# Altium project Table.PrjPcb
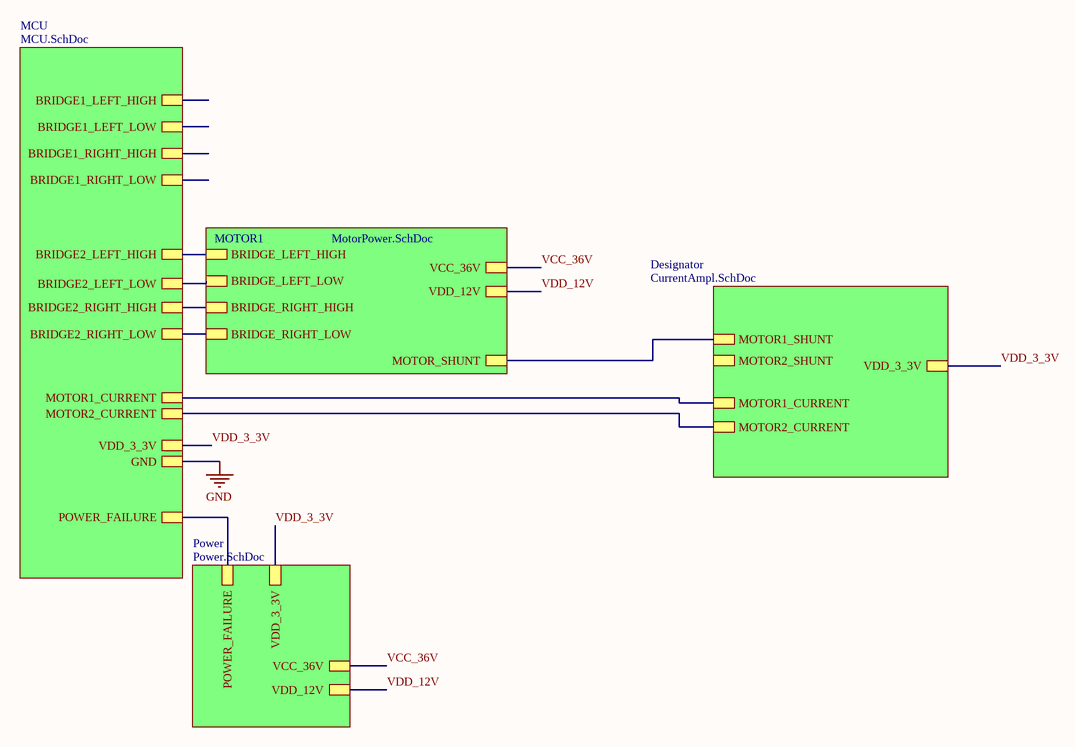
[diagram p0: Table.SchDoc]
5 sheets, 78 parts. Net scope: hierarchical (ports join the sheet entries above them; power ports are global).
Board file: PCB1.PcbDoc
Sheets:
  Table.SchDoc
    MCU = MCU.SchDoc
    MOTOR1 = MotorPower.SchDoc
    Designator = CurrentAmpl.SchDoc
    Power = Power.SchDoc

## Sheet Table.SchDoc
size A4

### Sub-sheets
Designator = CurrentAmpl.SchDoc: MOTOR1_SHUNT, MOTOR2_SHUNT, MOTOR2_CURRENT, MOTOR1_CURRENT, VDD_3_3V
MCU = MCU.SchDoc: BRIDGE1_LEFT_LOW, BRIDGE1_RIGHT_HIGH, BRIDGE1_RIGHT_LOW, BRIDGE1_LEFT_HIGH, BRIDGE2_LEFT_HIGH, BRIDGE2_RIGHT_HIGH, BRIDGE2_LEFT_LOW, BRIDGE2_RIGHT_LOW, VDD_3_3V, GND, POWER_FAILURE, MOTOR1_CURRENT, MOTOR2_CURRENT
MOTOR1 = MotorPower.SchDoc: MOTOR_SHUNT, VCC_36V, BRIDGE_LEFT_HIGH, VDD_12V, BRIDGE_LEFT_LOW, BRIDGE_RIGHT_HIGH, BRIDGE_RIGHT_LOW
Power = Power.SchDoc: POWER_FAILURE, VDD_12V, VDD_3_3V, VCC_36V

### Nets
VCC_36V: sheet MOTOR1/VCC_36V, sheet Power/VCC_36V
VDD_3_3V: sheet MCU/VDD_3_3V, sheet Designator/VDD_3_3V, sheet Power/VDD_3_3V
VDD_12V: sheet MOTOR1/VDD_12V, sheet Power/VDD_12V
NetC20_2: sheet MCU/MOTOR1_CURRENT, sheet Designator/MOTOR1_CURRENT
NetC22_2: sheet MCU/MOTOR2_CURRENT, sheet Designator/MOTOR2_CURRENT
NetR2_1: sheet MCU/POWER_FAILURE, sheet Power/POWER_FAILURE
NetR12_2: sheet MCU/BRIDGE2_LEFT_HIGH, sheet MOTOR1/BRIDGE_LEFT_HIGH
NetR14_1: sheet MCU/BRIDGE2_LEFT_LOW, sheet MOTOR1/BRIDGE_LEFT_LOW
NetR15_2: sheet MOTOR1/MOTOR_SHUNT, sheet Designator/MOTOR1_SHUNT
NetR18_2: sheet MCU/BRIDGE2_RIGHT_HIGH, sheet MOTOR1/BRIDGE_RIGHT_HIGH
NetR20_1: sheet MCU/BRIDGE2_RIGHT_LOW, sheet MOTOR1/BRIDGE_RIGHT_LOW

## Sheet MCU.SchDoc
size A4
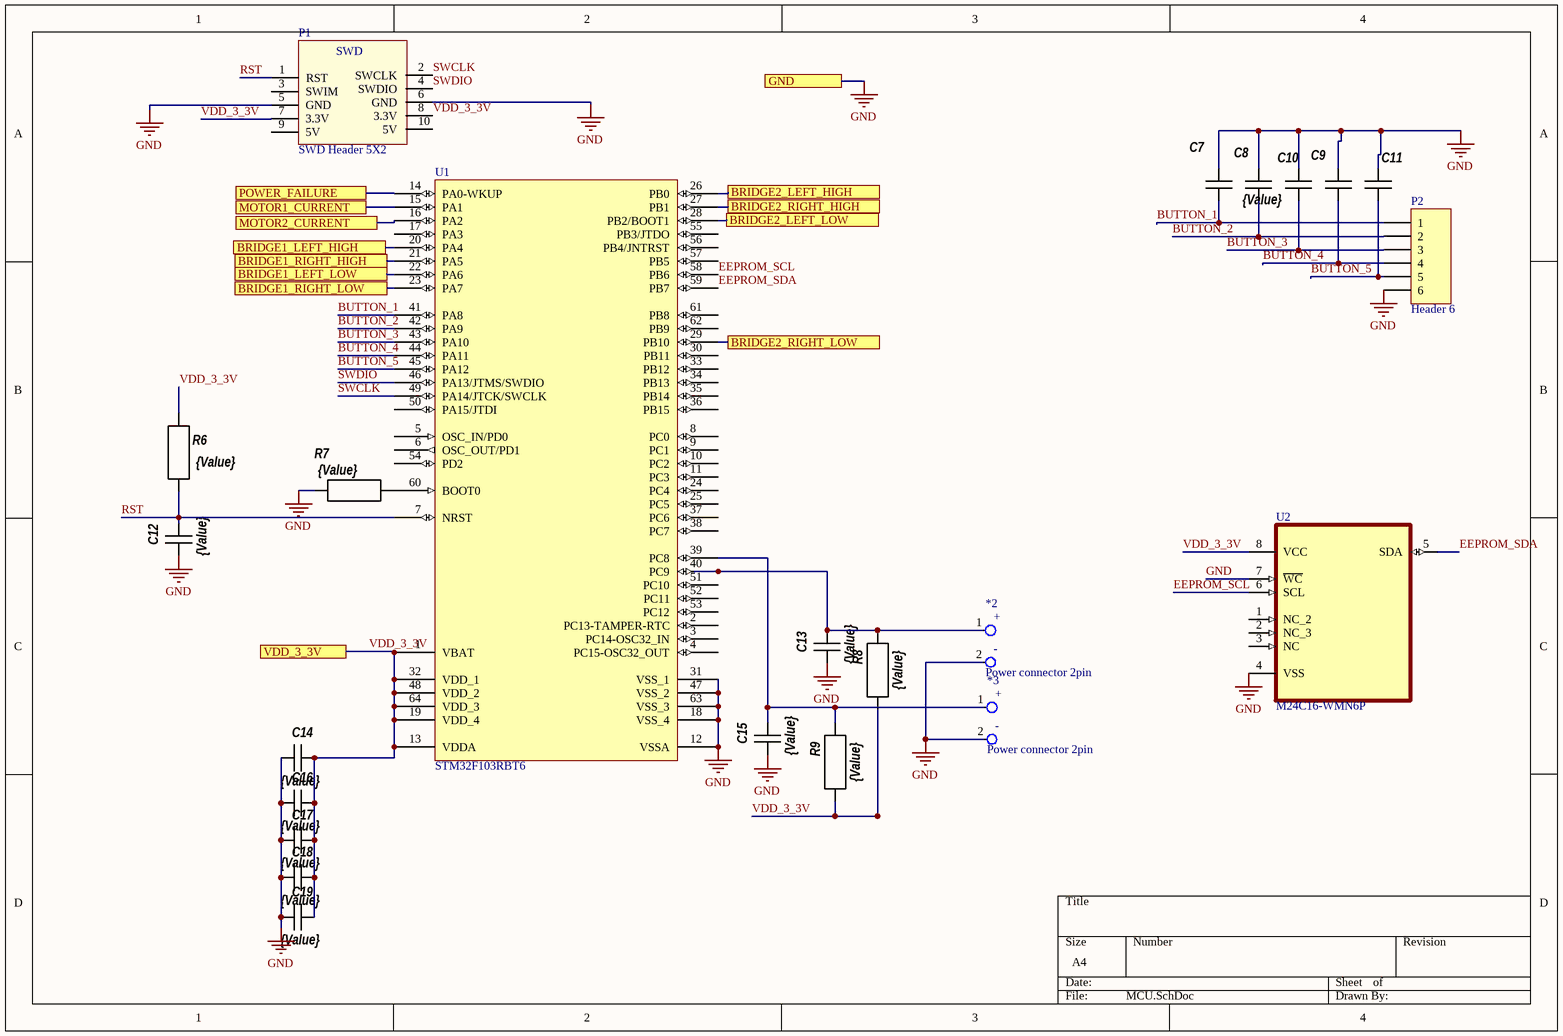
[diagram p1: MCU.SchDoc]

### Parts
*2  Power connector 2pin  [Power connector 2 pin]
*3  Power connector 2pin  [Power connector 2 pin]
C7  value {Value}  [R0805]  (hidden comment: Cap 0805)
C8  Cap 0805  [R0805]  (value not drawn)
C9  Cap 0805  [R0805]  (value not drawn)
C10  Cap 0805  [R0805]  (value not drawn)
C11  Cap 0805  [R0805]  (value not drawn)
C12  value {Value}  [R0805]  (hidden comment: Cap 0805)
C13  value {Value}  [R0805]  (hidden comment: Cap 0805)
C14  value {Value}  [R0805]  (hidden comment: Cap 0805)
C15  value {Value}  [R0805]  (hidden comment: Cap 0805)
C16  value {Value}  [R0805]  (hidden comment: Cap 0805)
C17  value {Value}  [R0805]  (hidden comment: Cap 0805)
C18  value {Value}  [R0805]  (hidden comment: Cap 0805)
C19  value {Value}  [R0805]  (hidden comment: Cap 0805)
P1  SWD Header 5X2  [HDR2X5]
P2  Header 6  [HDR1X6]
R6  value {Value}  [R0805]  (hidden comment: Res 0805)
R7  value {Value}  [R0805]  (hidden comment: Res 0805)
R8  value {Value}  [R0805]  (hidden comment: Res 0805)
R9  value {Value}  [R0805]  (hidden comment: Res 0805)
U1  STM32F103RBT6  [LQFP64_N]
U2  M24C16-WMN6P  [SOIC127P600X175-8N]

### Ports
BRIDGE1_LEFT_HIGH, BRIDGE1_LEFT_LOW, BRIDGE1_RIGHT_HIGH, BRIDGE1_RIGHT_LOW, BRIDGE2_LEFT_HIGH, BRIDGE2_LEFT_LOW, BRIDGE2_RIGHT_HIGH, BRIDGE2_RIGHT_LOW, GND, MOTOR1_CURRENT, MOTOR2_CURRENT, POWER_FAILURE, VDD_3_3V

### Nets
GND: *2.2 *3.2 C7.2 C8.2 C9.2 C10.2 C11.2 C12.1 C13.1 C14.1 C15.1 C16.1 C17.1 C18.1 C19.1 P1.5(GND) P1.6(GND) P2.6 R7.1 U1.12(VSSA) U1.18(VSS_4) U1.31(VSS_1) U1.47(VSS_2) U1.63(VSS_3) U2.4(VSS) U2.7(~{WC}) ; port GND
BUTTON_1: C7.1 P2.1 U1.41(PA8)
BUTTON_2: C8.1 P2.2 U1.42(PA9)
BUTTON_3: C10.1 P2.3 U1.43(PA10)
BUTTON_4: C9.1 P2.4 U1.44(PA11)
BUTTON_5: C11.1 P2.5 U1.45(PA12)
EEPROM_SCL: U1.58(PB6) U2.6(SCL)
EEPROM_SDA: U1.59(PB7) U2.5(SDA)
RST: C12.2 P1.1(RST) R6.1 U1.7(NRST)
SWCLK: P1.2(SWCLK) U1.49(PA14/JTCK/SWCLK)
SWDIO: P1.4(SWDIO) U1.46(PA13/JTMS/SWDIO)
VDD_3_3V: C14.2 C16.2 C17.2 C18.2 C19.2 P1.7(3.3V) P1.8(3.3V) R6.2 R8.1 R9.1 U1.1(VBAT) U1.13(VDDA) U1.19(VDD_4) U1.32(VDD_1) U1.48(VDD_2) U1.64(VDD_3) U2.8(VCC) ; port VDD_3_3V
Net*2_1: *2.1 C13.2 R8.2 U1.40(PC9)
Net*3_1: *3.1 C15.2 R9.2 U1.39(PC8)
NetC20_2: U1.15(PA1) ; port MOTOR1_CURRENT
NetC22_2: U1.16(PA2) ; port MOTOR2_CURRENT
NetR2_1: U1.14(PA0-WKUP) ; port POWER_FAILURE
NetR7_2: R7.2 U1.60(BOOT0)
NetR12_2: U1.26(PB0) ; port BRIDGE2_LEFT_HIGH
NetR14_1: U1.28(PB2/BOOT1) ; port BRIDGE2_LEFT_LOW
NetR18_2: U1.27(PB1) ; port BRIDGE2_RIGHT_HIGH
NetR20_1: U1.29(PB10) ; port BRIDGE2_RIGHT_LOW
NetU1_20: U1.20(PA4) ; port BRIDGE1_LEFT_HIGH
NetU1_21: U1.21(PA5) ; port BRIDGE1_RIGHT_HIGH
NetU1_22: U1.22(PA6) ; port BRIDGE1_LEFT_LOW
NetU1_23: U1.23(PA7) ; port BRIDGE1_RIGHT_LOW

Not connected (* = marked no-connect by the designer): P1 3(SWIM) 9(5V) 10(5V); U1 2(PC13-TAMPER-RTC) 3(PC14-OSC32_IN) 4(PC15-OSC32_OUT) 5(OSC_IN/PD0) 6(OSC_OUT/PD1) 8(PC0) 9(PC1) 10(PC2) 11(PC3) 17(PA3) 24(PC4) 25(PC5) 30(PB11) 33(PB12) 34(PB13) 35(PB14) 36(PB15) 37(PC6) 38(PC7) 50(PA15/JTDI) 51(PC10) 52(PC11) 53(PC12) 54(PD2) 55(PB3/JTDO) 56(PB4/JNTRST) 57(PB5) 61(PB8) 62(PB9); U2 1(NC_2) 2(NC_3) 3(NC)

### Notes on the sheet
- (in symbol Power connector 2pin) +; -
- (in symbol SWD Header 5X2) SWD

### Library data of the parts
C7-C19 = Cap 0805: Конденсатор 0805; Manufacturer: Murata; sm_pins: 2; th_pins: 0; Model: 0805
P1 = SWD Header 5X2: Header, 5-Pin, Dual row; LatestRevisionDate: 17-Jul-2002; LatestRevisionNote: Re-released for DXP Platform.; Publisher: Altium Limited
P2 = Header 6: Header, 6-Pin; LatestRevisionDate: 17-Jul-2002; LatestRevisionNote: Re-released for DXP Platform.; Publisher: Altium Limited
R6-R9 = Res 0805: Резистор 0805; Manufacturer: Yageo; sm_pins: 2; th_pins: 0; Model: *
U1 = STM32F103RBT6: STM32 ARM-based 32-bit MCU with 128 Kbytes Flash, 64-pin LQFP, Industrial Temperature; Published: 30-May-2008; DatasheetVersion: rev6, Mar-2008; PackageVersion: Mar-2008; PackageReference: LQFP64; Publisher: Altium Limited; PackageDescription: 64-Pin Low-Profile Quad Flat Pack, 10 x 10 mm Body, 0.5 mm Pitch (LQFP64); ComponentLink1Description: Manufacturer Link; ComponentLink1URL: www.st.com/stm32; ComponentLink2Description: Datasheet; ComponentLink2URL: http://www.st.com/stonline/products/literature/ds/13587.pdf
U2 = M24C16-WMN6P: EEPROM Memory IC 16Kb _2K x 8_ IÂ²C 400kHz 900ns 8-SO; MF: STMicroelectronics; Package: SO-8 STMicroelectronics; Availability: Unavailable; Value: *; MP: M24C16-WMN6P; SnapEDA_Link: https://www.snapeda.com/parts/M24C16-WMN6P/STMicroelectronics/view-part/42148/?ref=snap; Price: None

## Sheet MotorPower.SchDoc
size A4
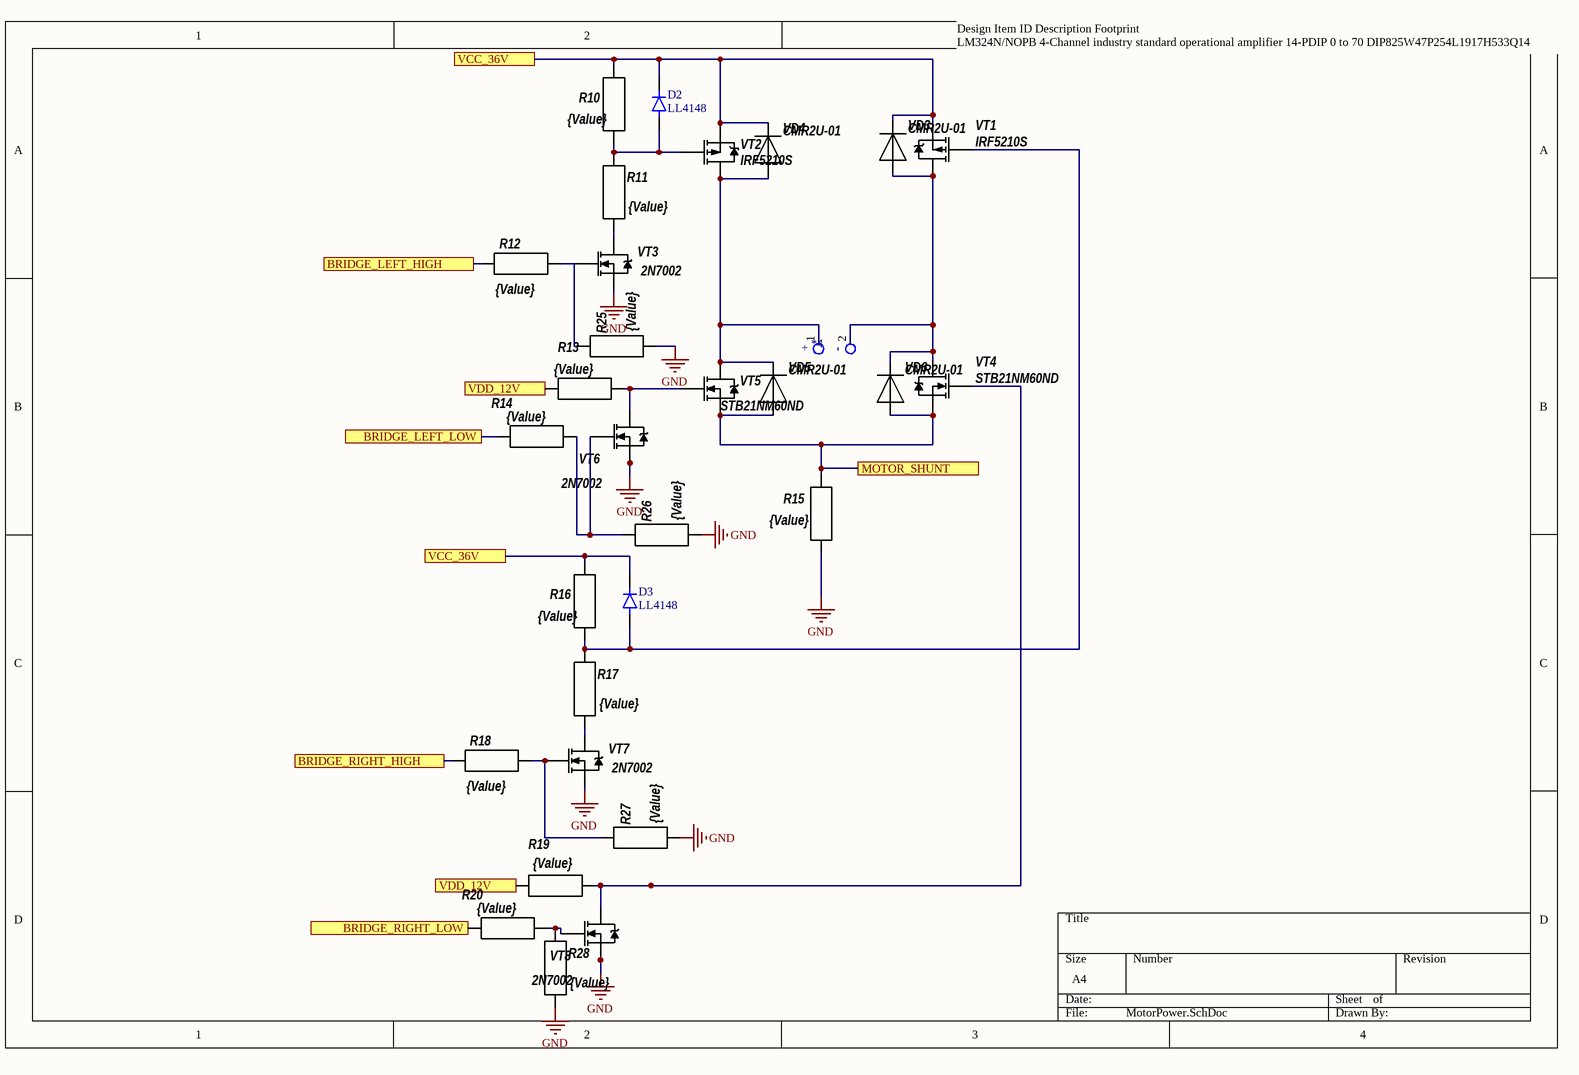
[diagram p2: MotorPower.SchDoc]

### Parts
*4  Power connector 2pin  [Power connector 2 pin]  (value not drawn)
D2  LL4148  [DIO_LL4148]
D3  LL4148  [DIO_LL4148]
R10  value {Value}  [R0805]  (hidden comment: Res 0805)
R11  value {Value}  [R0805]  (hidden comment: Res 0805)
R12  value {Value}  [R0805]  (hidden comment: Res 0805)
R13  value {Value}  [R0805]  (hidden comment: Res 0805)
R14  value {Value}  [R0805]  (hidden comment: Res 0805)
R15  value {Value}  [R2512]  (hidden comment: Res 2512)
R16  value {Value}  [R0805]  (hidden comment: Res 0805)
R17  value {Value}  [R0805]  (hidden comment: Res 0805)
R18  value {Value}  [R0805]  (hidden comment: Res 0805)
R19  value {Value}  [R0805]  (hidden comment: Res 0805)
R20  value {Value}  [R0805]  (hidden comment: Res 0805)
R25  value {Value}  [R0805]  (hidden comment: Res 0805)
R26  value {Value}  [R0805]  (hidden comment: Res 0805)
R27  value {Value}  [R0805]  (hidden comment: Res 0805)
R28  value {Value}  [R0805]  (hidden comment: Res 0805)
VD3  CMR2U-01  [SMB/DO-214AA]
VD4  CMR2U-01  [SMB/DO-214AA]
VD5  CMR2U-01  [SMB/DO-214AA]
VD6  CMR2U-01  [SMB/DO-214AA]
VT1  IRF5210S  [D2Pak]
VT2  IRF5210S  [D2Pak]
VT3  2N7002  [SOT-23]
VT4  STB21NM60ND  [D2Pak]
VT5  STB21NM60ND  [D2Pak]
VT6  2N7002  [SOT-23]
VT7  2N7002  [SOT-23]
VT8  2N7002  [SOT-23]

### Ports
BRIDGE_LEFT_HIGH, BRIDGE_LEFT_LOW, BRIDGE_RIGHT_HIGH, BRIDGE_RIGHT_LOW, MOTOR_SHUNT, VCC_36V, VDD_12V

### Nets
GND: R15.1 R25.1 R26.1 R27.1 R28.1 VT3.2(S) VT6.2(S) VT7.2(S) VT8.2(S)
VCC_36V: D2.C D3.C R10.2 R16.2 VD3.2 VD4.2 VT1.3(S) VT2.3(S) ; port VCC_36V
VDD_12V: R13.1 R19.1 ; port VDD_12V
Net*4_1: *4.1 VD4.1 VD5.2 VT2.2(D) VT5.2(D)
Net*4_2: *4.2 VD3.1 VD6.2 VT1.2(D) VT4.2(D)
NetD2_A: D2.A R10.1 R11.2 VT2.1(G)
NetD3_A: D3.A R16.1 R17.2 VT1.1(G)
NetR11_1: R11.1 VT3.3(D)
NetR12_1: R12.1 R25.2 VT3.1(G)
NetR12_2: R12.2 ; port BRIDGE_LEFT_HIGH
NetR13_2: R13.2 VT5.1(G) VT6.3(D)
NetR14_1: R14.1 ; port BRIDGE_LEFT_LOW
NetR14_2: R14.2 R26.2 VT6.1(G)
NetR15_2: R15.2 VD5.1 VD6.1 VT4.3(S) VT5.3(S) ; port MOTOR_SHUNT
NetR17_1: R17.1 VT7.3(D)
NetR18_1: R18.1 R27.2 VT7.1(G)
NetR18_2: R18.2 ; port BRIDGE_RIGHT_HIGH
NetR19_2: R19.2 VT4.1(G) VT8.3(D)
NetR20_1: R20.1 ; port BRIDGE_RIGHT_LOW
NetR20_2: R20.2 R28.2 VT8.1(G)

### Notes on the sheet
- Design Item ID	Description	Footprint
  LM324N/NOPB	4-Channel industry standard operational amplifier 14-PDIP 0 to 70	DIP825W47P254L1917H533Q14
- (in symbol Power connector 2pin) +; -

### Library data of the parts
D2 D3 = LL4148: Diode Standard 100V 200mA Surface Mount SOD-80; MF: ON Semiconductor; Package: SOD-80 Taitron; Availability: Unavailable; MP: LL4148; Value: *; SnapEDA_Link: https://www.snapeda.com/parts/LL4148/ON%20Semiconductor/view-part/2182678/?ref=snap; Price: None
R10-R14 R16-R20 R25-R28 = Res 0805: as R6 on sheet MCU; Model: *
R15 = Res 2512: Резистор 2512; Manufacturer: Yageo; sm_pins: 2; th_pins: 0; Model: 2512
VD3-VD6 = CMR2U-01: Ultrafast, 100V, 2A, 50 ns; Manufacturer: Central Semiconductor Corp; Model: CMR2U-01
VT1 VT2 = IRF5210S: P-chanel, 100V, 40A, 60 mOhm; Manufacturer: International Rectifier; Model: IRF5210SPBF
VT3 VT6-VT8 = 2N7002: 60V, 200 mA, N-chanel; Manufacturer: ON Semiconductor; sm_pins: 3; th_pins: 0; Model: 2N7002LT1G
VT4 VT5 = STB21NM60ND: D2pak, 600V, 17А, 170 mOhm; Manufacturer: ST Microelectronics; Model: STB21NM60ND

## Sheet CurrentAmpl.SchDoc
size A4
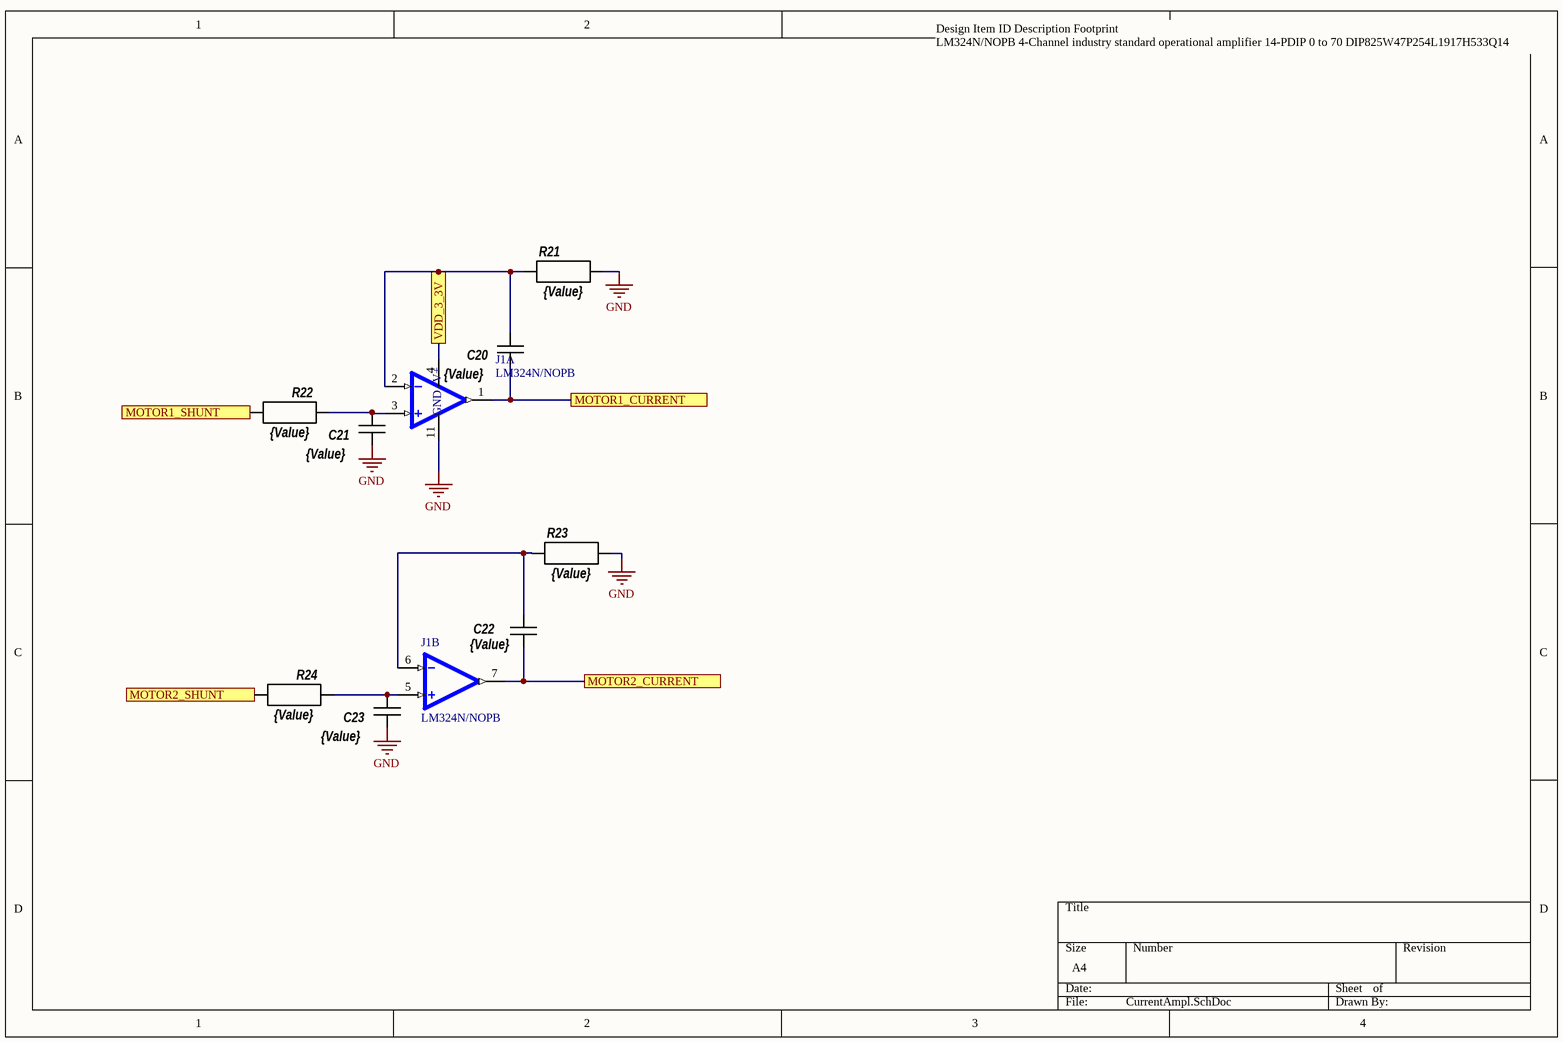
[diagram p3: CurrentAmpl.SchDoc]

### Parts
C20  value {Value}  [C0805]  (hidden comment: Cap 0805)
C21  value {Value}  [C0805]  (hidden comment: Cap 0805)
C22  value {Value}  [C0805]  (hidden comment: Cap 0805)
C23  value {Value}  [C0805]  (hidden comment: Cap 0805)
J1  LM324N/NOPB  [DIP825W47P254L1917H533Q14]  (parts A,B of 4)
R21  value {Value}  [R0805]  (hidden comment: Res 0805)
R22  value {Value}  [R0805]  (hidden comment: Res 0805)
R23  value {Value}  [R0805]  (hidden comment: Res 0805)
R24  value {Value}  [R0805]  (hidden comment: Res 0805)

### Ports
MOTOR1_CURRENT, MOTOR1_SHUNT, MOTOR2_CURRENT, MOTOR2_SHUNT, VDD_3_3V

### Nets
GND: C21.2 C23.2 J1.11(GND) R21.1 R23.1
VDD_3_3V: C20.1 J1.2(1IN-) J1.4(V+) R21.2 ; port VDD_3_3V
NetC20_2: C20.2 J1.1(1OUT) ; port MOTOR1_CURRENT
NetC21_1: C21.1 J1.3(1IN+) R22.2
NetC22_1: C22.1 J1.6(2IN-) R23.2
NetC22_2: C22.2 J1.7(2OUT) ; port MOTOR2_CURRENT
NetC23_1: C23.1 J1.5(2IN+) R24.2
NetR15_2: R22.1 ; port MOTOR1_SHUNT
NetR24_1: R24.1 ; port MOTOR2_SHUNT

### Notes on the sheet
- Design Item ID	Description	Footprint
  LM324N/NOPB	4-Channel industry standard operational amplifier 14-PDIP 0 to 70	DIP825W47P254L1917H533Q14

### Library data of the parts
C20-C23 = Cap 0805: as C7 on sheet MCU
J1 = LM324N/NOPB: 4-Channel industry standard operational amplifier 14-PDIP 0 to 70; MP: LM324N; MF: Texas Instruments; Purchase-URL: https://pricing.snapeda.com/search/part/LM324N/?ref=eda; Package: PDIP-14 Texas Instruments; Price: None; Value: *; Availability: Good; Check_prices: https://www.snapeda.com/parts/LM324N/Texas%20Instruments/view-part/295/?ref=eda; SnapEDA_Link: https://www.snapeda.com/parts/LM324N/Texas%20Instruments/view-part/295/?ref=snap
R21-R24 = Res 0805: as R6 on sheet MCU; Model: *

## Sheet Power.SchDoc
size A4
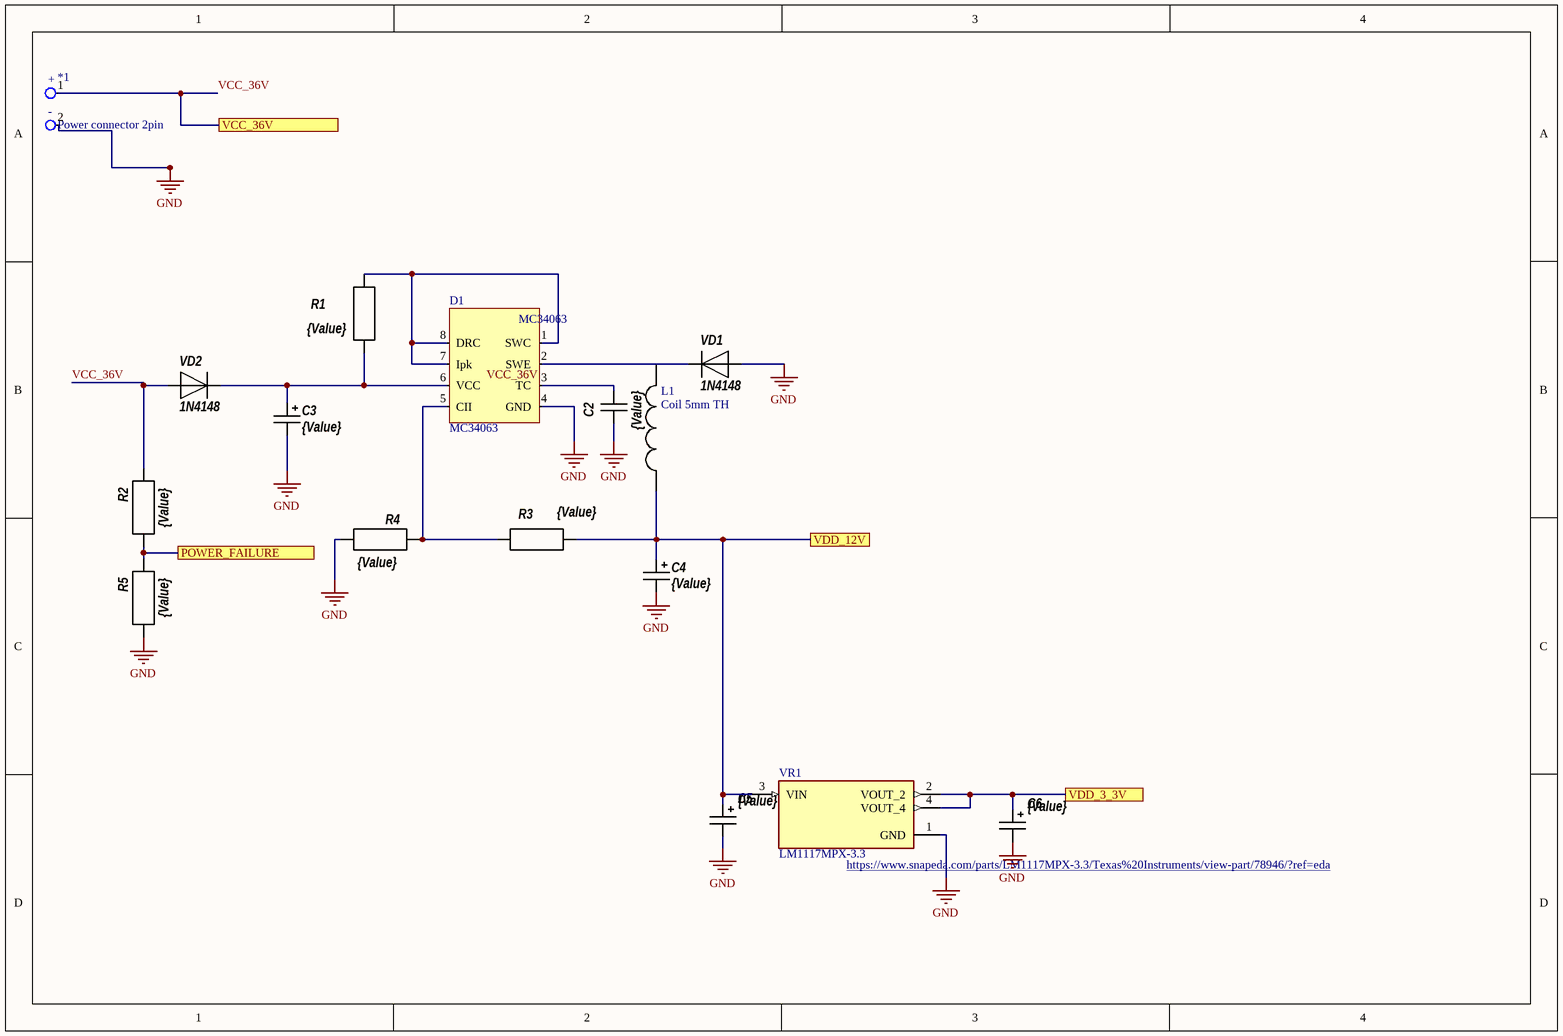
[diagram p4: Power.SchDoc]

### Parts
*1  Power connector 2pin  [Power connector 2 pin]
C2  value {Value}  [R0805]  (hidden comment: Cap 0805)
C3  value {Value}  [Cap Alum 8x10.5 mm]  (hidden comment: 100 uF 50V)
C4  value {Value}  [Cap Alum 8x10.5 mm]  (hidden comment: 100 uF 50V)
C5  value {Value}  [Tantal type B]  (hidden comment: Cap tan_B)
C6  value {Value}  [Tantal type B]  (hidden comment: Cap tan_B)
D1  MC34063  [MC34063]
L1  Coil 5mm TH  [Coil 5mm TH]
R1  value {Value}  [R0805]  (hidden comment: Res 0805)
R2  value {Value}  [R0805]  (hidden comment: Res 0805)
R3  value {Value}  [R0805]  (hidden comment: Res 0805)
R4  value {Value}  [R0805]  (hidden comment: Res 0805)
R5  value {Value}  [R0805]  (hidden comment: Res 0805)
VD1  1N4148  [SOD-80]
VD2  1N4148  [SOD-80]
VR1  LM1117MPX-3.3  [VREG_LM1117MPX-3.3]

### Ports
POWER_FAILURE, VCC_36V, VDD_3_3V, VDD_12V

### Nets
GND: *1.2 C2.2 C3.2 C4.2 C5.2 C6.2 D1.4(GND) R4.1 R5.1 VD1.1 VR1.1(GND)
VCC_36V: *1.1 R2.2 VD2.1 ; port VCC_36V
VDD_3_3V: C6.1 VR1.2(VOUT_2) VR1.4(VOUT_4) ; port VDD_3_3V
VDD_12V: C4.1 C5.1 L1.1 R3.1 VR1.3(VIN) ; port VDD_12V
NetC2_1: C2.1 D1.3(TC)
NetC3_1: C3.1 D1.6(VCC) R1.2 VD2.2
NetD1_1: D1.1(SWC) D1.7(Ipk) D1.8(DRC) R1.1
NetD1_2: D1.2(SWE) L1.2 VD1.2
NetD1_5: D1.5(CII) R3.2 R4.2
NetR2_1: R2.1 R5.2 ; port POWER_FAILURE

### Notes on the sheet
- Labels drawn without touching a wire or pin: VCC_36V
- (in symbol Power connector 2pin) +; -

### Library data of the parts
C2 = Cap 0805: as C7 on sheet MCU
C3 C4 = Cap Alum: SMT 8 x 10.5 мм; Manufacturer: Epcos
C5 C6 = Cap tan_B: type B; Manufacturer: AVX
R1-R5 = Res 0805: as R6 on sheet MCU; Model: *
VD1 VD2 = 1N4148: 4 ns, 100V, 150 mA; Manufacturer: NXP; Model: 1N4148
VR1 = LM1117MPX-3.3: 800-mA 15-V linear voltage regulator 4-SOT-223; MF: Texas Instruments; Price: None; Value: *; Package: SOT-223-4 Texas Instruments; SnapEDA_Link: https://www.snapeda.com/parts/LM1117MPX-3.3/Texas%20Instruments/view-part/78946/?ref=snap; Mouser-Purchase-URL: https://snapeda.com/shop?store=Mouser&id=78946; Availability: Warning; Texas_Instruments-Purchase-URL: https://snapeda.com/shop?store=Texas+Instruments&id=78946; MP: LM1117MPX-3.3; Check_prices: https://www.snapeda.com/parts/LM1117MPX-3.3/Texas%20Instruments/view-part/78946/?ref=eda

## Nets that join several sheets
GND: MCU (26 pins), MotorPower (9 pins), CurrentAmpl (5 pins), Power (11 pins)
NetC20_2: MCU (U1.15), CurrentAmpl (C20.2 J1.1)
NetC22_2: MCU (U1.16), CurrentAmpl (C22.2 J1.7)
NetR2_1: MCU (U1.14), Power (R2.1 R5.2)
NetR12_2: MCU (U1.26), MotorPower (R12.2)
NetR14_1: MCU (U1.28), MotorPower (R14.1)
NetR15_2: MotorPower (5 pins), CurrentAmpl (R22.1)
NetR18_2: MCU (U1.27), MotorPower (R18.2)
NetR20_1: MCU (U1.29), MotorPower (R20.1)
VCC_36V: MotorPower (8 pins), Power (*1.1 R2.2 VD2.1)
VDD_3_3V: MCU (17 pins), CurrentAmpl (C20.1 J1.2 J1.4 R21.2), Power (C6.1 VR1.2 VR1.4)
VDD_12V: MotorPower (R13.1 R19.1), Power (5 pins)